# EAGLE schematic flute (EAGLE 6.1)
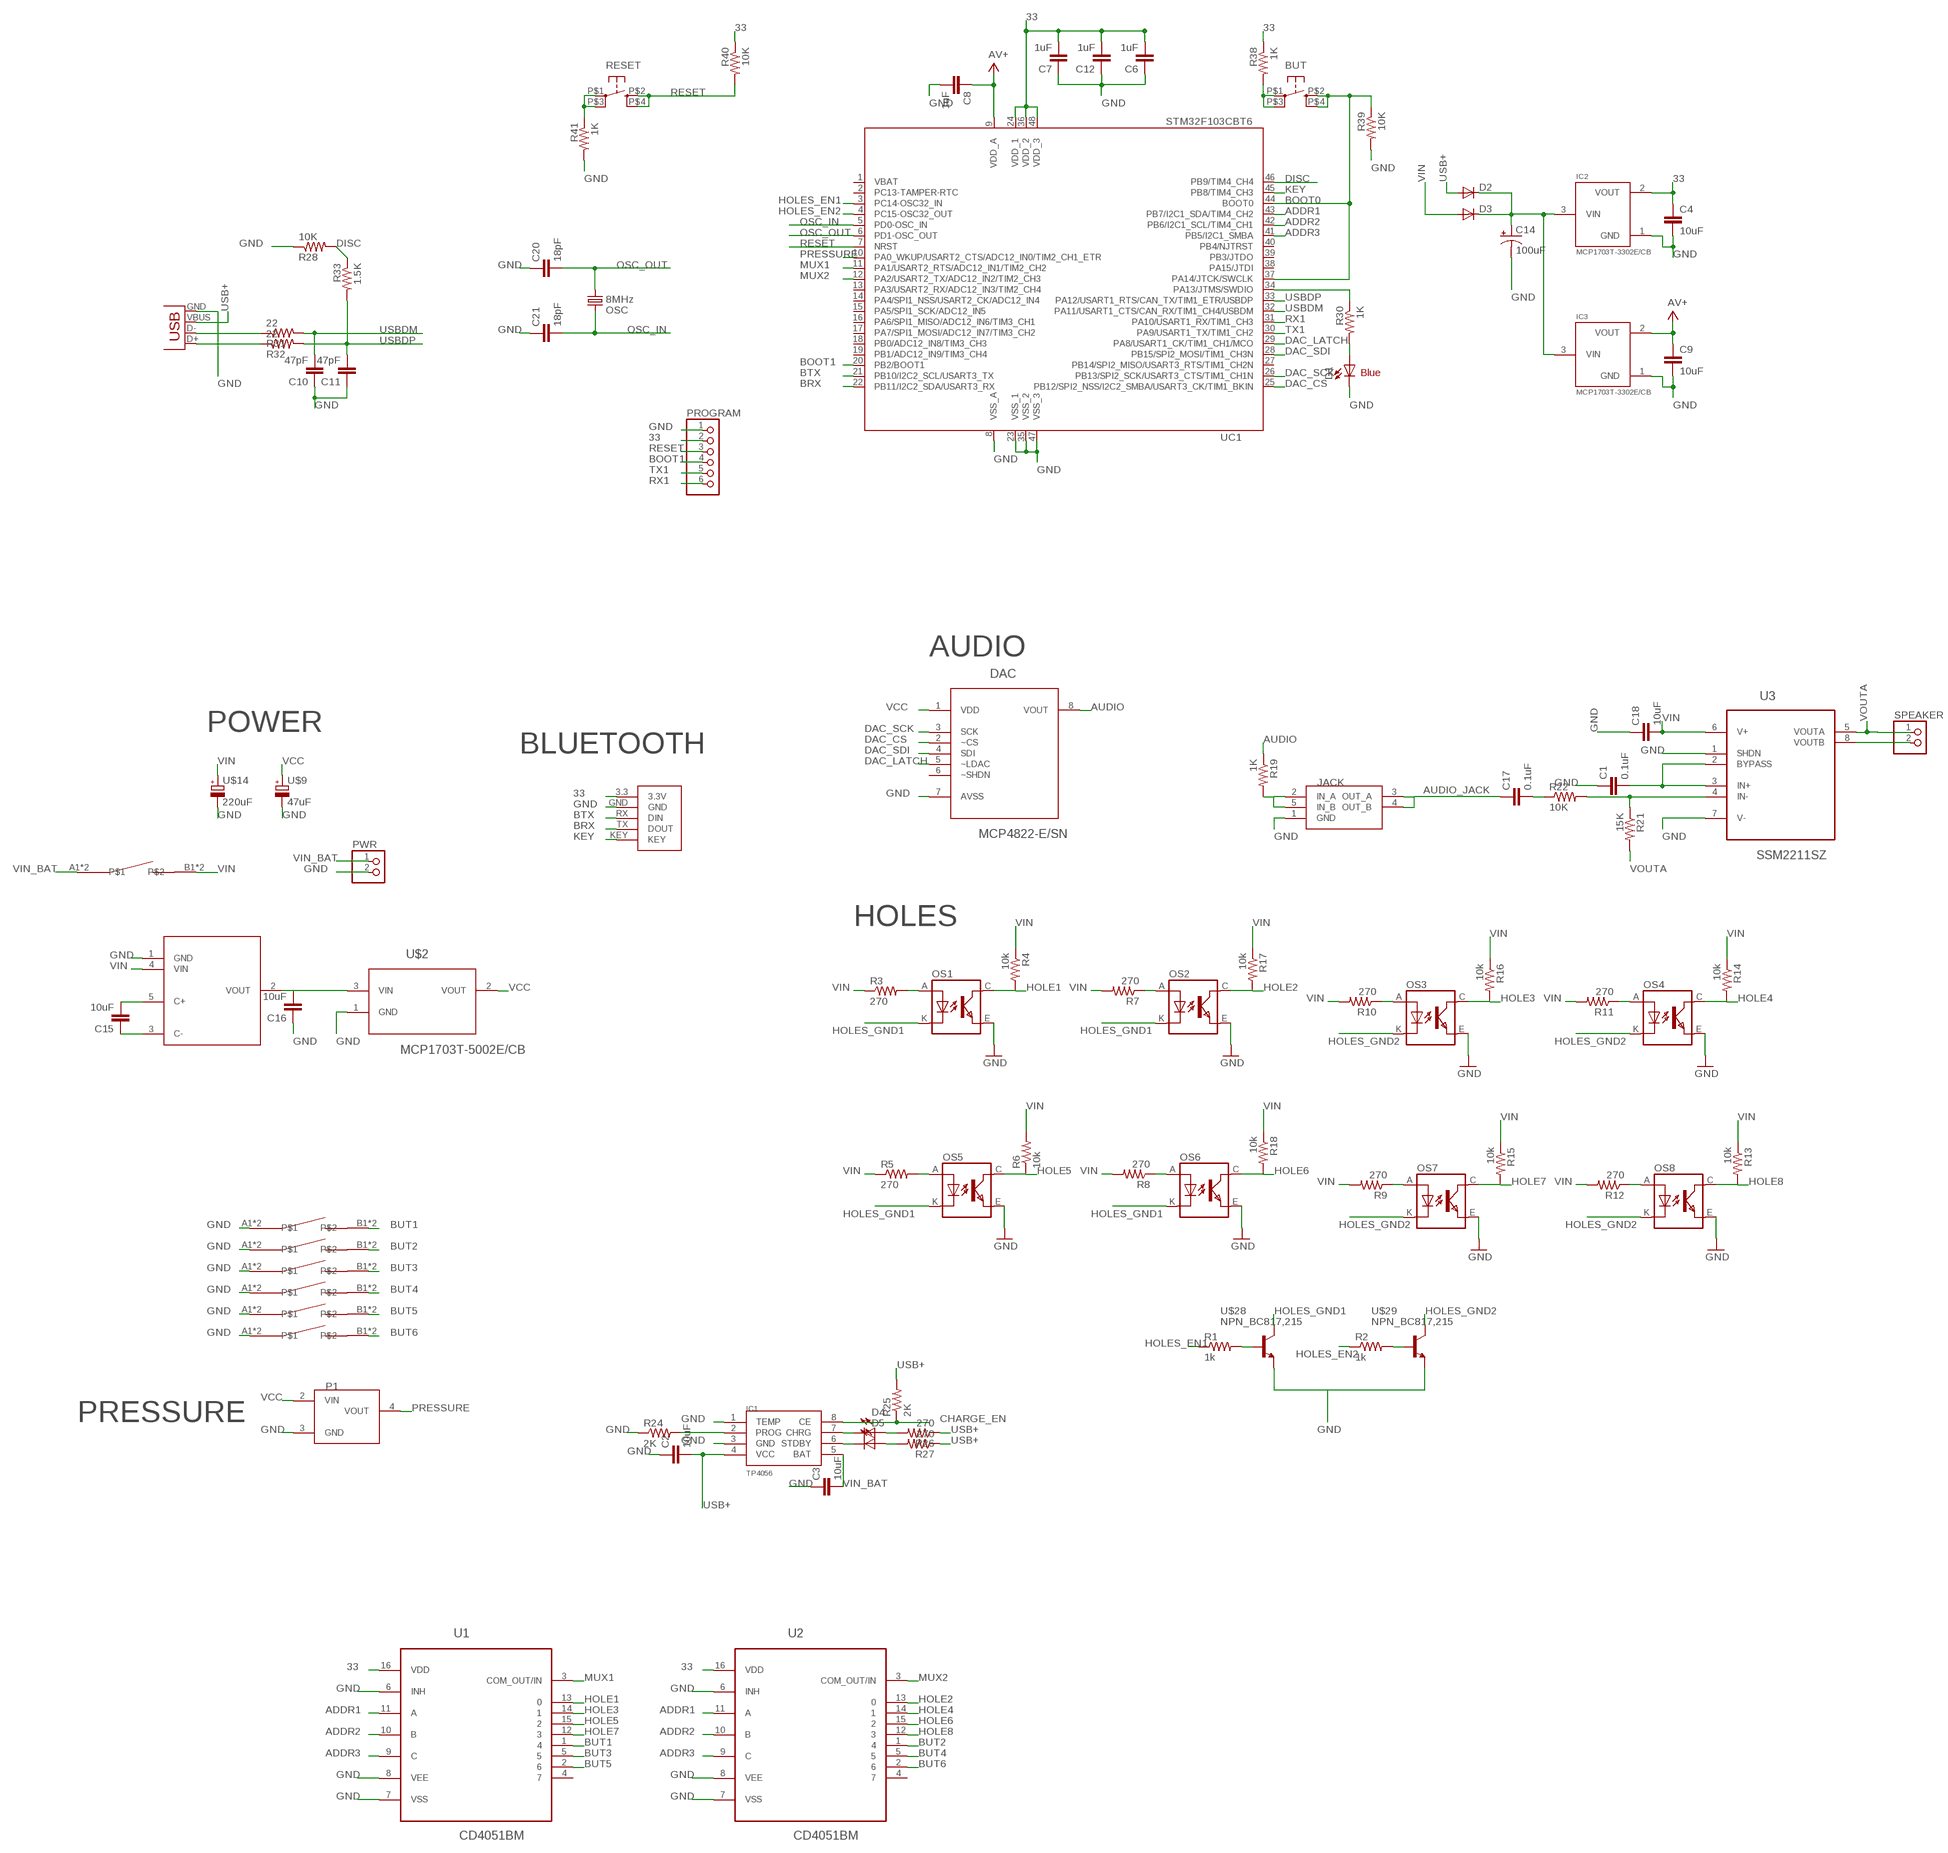
[diagram p0: schematic, sheet 1]

## Parts
BUT  KMR211GLFS  BUTTON-KMR241GLFS  [PUSHBUTTON-KMR241GLFS]
C1  0.1uF  CAP0805  [0805]
C2  10uF  CAP0805  [0805]
C3  10uF  CAP0805  [0805]
C4  10uF  CAP0805  [0805]
C6  1uF  CAP0805  [0805]
C7  1uF  CAP0805  [0805]
C8  1uF  CAP0805  [0805]
C9  10uF  CAP0805  [0805]
C10  47pF  CAP0805  [0805]
C11  47pF  CAP0805  [0805]
C12  1uF  CAP0805  [0805]
C14  100uF  CAP_POL1206  [EIA3216]
C15  10uF  CAP0805  [0805]
C16  10uF  CAP0805  [0805]
C17  0.1uF  CAP0805  [0805]
C18  10uF  CAP0805  [0805]
C20  18pF  CAP0805  [0805]
C21  18pF  CAP0805  [0805]
D1  Blue  LED1206  [LED-1206]
D2  DIODESOD  [SOD-323]
D3  DIODESOD  [SOD-323]
D4  Red  LED1206  [LED-1206]
D5  Green  LED1206  [LED-1206]
DAC  MCP4822-E/SN  [SOIC8-N_MC]
IC1  TP4056  [SOP-8]
IC2  MCP1703T-3302E/CB  MCP1700T  [SOT23]
IC3  MCP1703T-3302E/CB  MCP1700T  [SOT23]
JACK  JACK  [3F07]
OS1  TCRT5000  [TCRT5000]
OS2  TCRT5000  [TCRT5000]
OS3  TCRT5000  [TCRT5000]
OS4  TCRT5000  [TCRT5000]
OS5  TCRT5000  [TCRT5000]
OS6  TCRT5000  [TCRT5000]
OS7  TCRT5000  [TCRT5000]
OS8  TCRT5000  [TCRT5000]
OSC  8MHz  CRYSTAL5X3  [CRYSTAL-SMD-5X3]
P1  PRESSURE_SENSOR  [MPXV5050GP]
PROGRAM  CONNEC_1X066PADS  [6PADS]
PWR  CONNEC_1X02BASIC  [CONNEC_1X02]
R1  1k  RESISTOR0805-RES  [0805]
R2  1k  RESISTOR0805-RES  [0805]
R3  270  RESISTOR0805-RES  [0805]
R4  10k  RESISTOR0805-RES  [0805]
R5  270  RESISTOR0805-RES  [0805]
R6  10k  RESISTOR0805-RES  [0805]
R7  270  RESISTOR0805-RES  [0805]
R8  270  RESISTOR0805-RES  [0805]
R9  270  RESISTOR0805-RES  [0805]
R10  270  RESISTOR0805-RES  [0805]
R11  270  RESISTOR0805-RES  [0805]
R12  270  RESISTOR0805-RES  [0805]
R13  10k  RESISTOR0805-RES  [0805]
R14  10k  RESISTOR0805-RES  [0805]
R15  10k  RESISTOR0805-RES  [0805]
R16  10k  RESISTOR0805-RES  [0805]
R17  10k  RESISTOR0805-RES  [0805]
R18  10k  RESISTOR0805-RES  [0805]
R19  1K  RESISTOR0805-RES  [0805]
R21  15K  RESISTOR0805-RES  [0805]
R22  10K  RESISTOR0805-RES  [0805]
R24  2K  RESISTOR0805-RES  [0805]
R25  2K  RESISTOR0805-RES  [0805]
R26  270  RESISTOR0805-RES  [0805]
R27  270  RESISTOR0805-RES  [0805]
R28  10K  RESISTOR0805-RES  [0805]
R30  1K  RESISTOR0805-RES  [0805]
R31  22  RESISTOR0805-RES  [0805]
R32  22  RESISTOR0805-RES  [0805]
R33  1.5K  RESISTOR0805-RES  [0805]
R38  1K  RESISTOR0805-RES  [0805]
R39  10K  RESISTOR0805-RES  [0805]
R40  10K  RESISTOR0805-RES  [0805]
R41  1K  RESISTOR0805-RES  [0805]
RESET  KMR211GLFS  BUTTON-KMR241GLFS  [PUSHBUTTON-KMR241GLFS]
SPEAKER  CONNEC_1X02BASIC  [CONNEC_1X02]
U1  CD4051BM  [SOIC127P600X175-16N]
U2  CD4051BM  [SOIC127P600X175-16N]
U3  SSM2211SZ  [SOIC127P600X175-8N]
U$1  MAX1683  [SOT23-5]
U$2  MCP1703T-5002E/CB  [SOT95P300X145-3N]
U$9  47uF  CPOL_EUPANASONIC_D  [PANASONIC_D]
U$14  220uF  CPOL_EUPANASONIC_D8  [PANASONIC_D8]
U$16  SWITCHKCD11  [KCD11]
U$18  SWITCH6X6X10  [SWITCH_6X6X10]
U$19  SWITCH6X6X10  [SWITCH_6X6X10]
U$20  SWITCH6X6X10  [SWITCH_6X6X10]
U$21  SWITCH6X6X10  [SWITCH_6X6X10]
U$22  SWITCH6X6X10  [SWITCH_6X6X10]
U$23  SWITCH6X6X10  [SWITCH_6X6X10]
U$24  HC05  [HC-05]
U$28  NPN_BC817,215  [SOT-23]
U$29  NPN_BC817,215  [SOT-23]
UC1  STM32F103CBT6  STM32F103CB  [LQFP48]
X1  USB-MINIB  USBSMD  [USB-MINIB]

## Nets
32: BUT.P$2 BUT.P$4 R39.1 UC1.37(PA14/JTCK/SWCLK) UC1.44(BOOT0)
33: C4.1 C6.2 C7.2 C12.2 IC2.2(VOUT) PROGRAM.2 R38.1 R40.1 U1.16(VDD) U2.16(VDD) U$24.3.3(3.3V) UC1.24(VDD_1) UC1.36(VDD_2) UC1.48(VDD_3)
ADDR1: U1.11(A) U2.11(A) UC1.43(PB7/I2C1_SDA/TIM4_CH2)
ADDR2: U1.10(B) U2.10(B) UC1.42(PB6/I2C1_SCL/TIM4_CH1)
ADDR3: U1.9(C) U2.9(C) UC1.41(PB5/I2C1_SMBA)
AUDIO: DAC.8(VOUT) R19.1
AUDIO_JACK: C17.1 JACK.3(OUT_A) JACK.4(OUT_B)
AV+: C8.1 C9.1 IC3.2(VOUT) UC1.9(VDD_A)
BOOT1: PROGRAM.4 UC1.20(PB2/BOOT1)
BRX: U$24.TX(DOUT) UC1.22(PB11/I2C2_SDA/USART3_RX)
BTX: U$24.RX(DIN) UC1.21(PB10/I2C2_SCL/USART3_TX)
BUT1: U1.1 U$18.B1 U$18.B2
BUT2: U2.1 U$19.B1 U$19.B2
BUT3: U1.5 U$20.B1 U$20.B2
BUT4: U2.5 U$21.B1 U$21.B2
BUT5: U1.2 U$22.B1 U$22.B2
BUT6: U2.2 U$23.B1 U$23.B2
CHARGE_EN: IC1.8(CE) R25.1
DAC_CS: DAC.2(~CS) UC1.25(PB12/SPI2_NSS/I2C2_SMBA/USART3_CK/TIM1_BKIN)
DAC_LATCH: DAC.5(~LDAC) UC1.29(PA8/USART1_CK/TIM1_CH1/MCO)
DAC_SCK: DAC.3(SCK) UC1.26(PB13/SPI2_SCK/USART3_CTS/TIM1_CH1N)
DAC_SDI: DAC.4(SDI) UC1.28(PB15/SPI2_MOSI/TIM1_CH3N)
DISC: R28.2 R33.1 UC1.46(PB9/TIM4_CH4)
GND [alim]: C1.1 C2.1 C3.1 C4.2 C6.1 C7.1 C8.2 C9.2 C10.1 C11.1 C12.1 C14.C(-) C16.1 C18.1 C20.1 C21.1 D1.C DAC.7(AVSS) IC1.1(TEMP) IC1.3(GND) IC2.1(GND) IC3.1(GND) JACK.1(GND) OS1.E(EMITTER) OS2.E(EMITTER) OS3.E(EMITTER) OS4.E(EMITTER) OS5.E(EMITTER) OS6.E(EMITTER) OS7.E(EMITTER) OS8.E(EMITTER) P1.3(GND) PROGRAM.1 PWR.2 R24.1 R28.1 R39.2 R41.2 U1.6(INH) U1.7(VSS) U1.8(VEE) U2.6(INH) U2.7(VSS) U2.8(VEE) U3.1(SHDN) U3.7(V-) U$1.1(GND) U$2.1(GND) U$9.- U$14.- U$18.A1 U$18.A2 U$19.A1 U$19.A2 U$20.A1 U$20.A2 U$21.A1 U$21.A2 U$22.A1 U$22.A2 U$23.A1 U$23.A2 U$24.GND U$28.2(E) U$29.2(E) UC1.8(VSS_A) UC1.23(VSS_1) UC1.35(VSS_2) UC1.47(VSS_3) X1.GND
HOLE1: OS1.C(COLLECTOR) R4.2 U1.13
HOLE2: OS2.C(COLLECTOR) R17.2 U2.13
HOLE3: OS3.C(COLLECTOR) R16.2 U1.14
HOLE4: OS4.C(COLLECTOR) R14.2 U2.14
HOLE5: OS5.C(COLLECTOR) R6.1 U1.15
HOLE6: OS6.C(COLLECTOR) R18.2 U2.15
HOLE7: OS7.C(COLLECTOR) R15.2 U1.12
HOLE8: OS8.C(COLLECTOR) R13.2 U2.12
HOLES_EN1: R1.1 UC1.3(PC14-OSC32_IN)
HOLES_EN2: R2.1 UC1.4(PC15-OSC32_OUT)
HOLES_GND1: OS1.K(CATHODE) OS2.K(CATHODE) OS5.K(CATHODE) OS6.K(CATHODE) U$28.3(C)
HOLES_GND2: OS3.K(CATHODE) OS4.K(CATHODE) OS7.K(CATHODE) OS8.K(CATHODE) U$29.3(C)
KEY: U$24.KEY UC1.45(PB8/TIM4_CH3)
MUX1: U1.3(COM_OUT/IN) UC1.11(PA1/USART2_RTS/ADC12_IN1/TIM2_CH2)
MUX2: U2.3(COM_OUT/IN) UC1.12(PA2/USART2_TX/ADC12_IN2/TIM2_CH3)
N$1: C1.2 U3.2(BYPASS) U3.3(IN+)
N$2: R21.1 R22.2 U3.4(IN-)
N$3: R1.2 U$28.1(B)
N$4: R2.2 U$29.1(B)
N$5: OS1.A(ANODE) R3.2
N$6: D5.A R27.2
N$7: OS2.A(ANODE) R7.1
N$8: JACK.2(IN_A) JACK.5(IN_B) R19.2
N$9: OS3.A(ANODE) R10.1
N$10: C17.2 R22.1
N$11: OS4.A(ANODE) R11.1
N$12: SPEAKER.2 U3.8(VOUTB)
N$13: OS5.A(ANODE) R5.2
N$15: OS6.A(ANODE) R8.1
N$16: D4.A R26.2
N$17: OS7.A(ANODE) R9.1
N$19: OS8.A(ANODE) R12.1
N$21: IC1.2(PROG) R24.2
N$22: C15.1 U$1.3(C-)
N$24: D4.C IC1.7(CHRG)
N$25: D5.C IC1.6(STDBY)
N$26: BUT.P$1 BUT.P$3 R38.2
N$27: R41.1 RESET.P$1 RESET.P$3
N$28: D1.A R30.2
N$29: R30.1 UC1.34(PA13/JTMS/SWDIO)
N$30: C15.2 U$1.5(C+)
N$31: C16.2 U$1.2(VOUT) U$2.3(VIN)
N$59: R31.1 X1.D-
N$60: R32.1 X1.D+
OSC_IN: C21.2 OSC.3 UC1.5(PD0-OSC_IN)
OSC_OUT: C20.2 OSC.1 UC1.6(PD1-OSC_OUT)
PRESSURE: P1.4(VOUT) UC1.10(PA0_WKUP/USART2_CTS/ADC12_IN0/TIM2_CH1_ETR)
RESET: PROGRAM.3 R40.2 RESET.P$2 RESET.P$4 UC1.7(NRST)
RX1: PROGRAM.6 UC1.31(PA10/USART1_RX/TIM1_CH3)
TX1: PROGRAM.5 UC1.30(PA9/USART1_TX/TIM1_CH2)
USB+: C2.2 D2.2(A) IC1.4(VCC) R25.2 R26.1 R27.1 X1.VBUS
USBDM: C10.2 R31.2 UC1.32(PA11/USART1_CTS/CAN_RX/TIM1_CH4/USBDM)
USBDP: C11.2 R32.2 R33.2 UC1.33(PA12/USART1_RTS/CAN_TX/TIM1_ETR/USBDP)
VCC [alim]: DAC.1(VDD) P1.2(VIN) U$2.2(VOUT) U$9.+
VIN [alim]: C18.2 D3.2(A) R3.1 R4.1 R5.1 R6.2 R7.2 R8.2 R9.2 R10.2 R11.2 R12.2 R13.1 R14.1 R15.1 R16.1 R17.1 R18.1 U3.6(V+) U$1.4(VIN) U$14.+ U$16.B1 U$16.B2
VIN_BAT [alim]: C3.2 IC1.5(BAT) PWR.1 U$16.A1 U$16.A2
VIN_REGS [alim]: C14.A(+) D2.1(C) D3.1(C) IC2.3(VIN) IC3.3(VIN)
VOUTA: R21.2 SPEAKER.1 U3.5(VOUTA)
Unconnected: DAC.6(~SHDN) U1.4 U2.4 UC1.2(PC13-TAMPER-RTC) UC1.13(PA3/USART2_RX/ADC12_IN3/TIM2_CH4) UC1.14(PA4/SPI1_NSS/USART2_CK/ADC12_IN4) UC1.15(PA5/SPI1_SCK/ADC12_IN5) UC1.16(PA6/SPI1_MISO/ADC12_IN6/TIM3_CH1) UC1.17(PA7/SPI1_MOSI/ADC12_IN7/TIM3_CH2) UC1.18(PB0/ADC12_IN8/TIM3_CH3) UC1.19(PB1/ADC12_IN9/TIM3_CH4) UC1.27(PB14/SPI2_MISO/USART3_RTS/TIM1_CH2N) UC1.38(PA15/JTDI) UC1.39(PB3/JTDO) UC1.40(PB4/NJTRST)

## Notes on the sheet
- BOOT0
- Blue
- AUDIO
- POWER
- BLUETOOTH
- HOLES
- PRESSURE

## Power pins joined to a net without a drawn wire
VBAT: UC1.1(VBAT)

## Library data of the parts
BUT RESET = okie:BUTTON-KMR241GLFS
C1-C3 C6-C8 C10-C12 C15-C18 C20 C21 = SparkFun-Passives:CAP: Capacitor Standard 0603 ceramic capacitor, and 0.1" leaded capacitor.
C4 C9 = SparkFun2:CAP: Capacitor Standard 0603 ceramic capacitor, and 0.1" leaded capacitor.
C14 = SparkFun3:CAP_POL: Capacitor Polarized These are standard SMD and PTH capacitors. Normally 10uF, 47uF, and 100uF in electrolytic and tantalum varieties. Always verify the external diameter of the through hole cap, it varies with capacity, voltage, and manufacturer. The EIA devices should be standard.
D1 D4 D5 = SparkFun:LED: LEDs Standard schematic elements and footprints for 5mm, 3mm, 1206, and 0603 sized LEDs. 5mm - Spark Fun Electronics SKU : COM-00529 (and others)
D2 D3 = SparkFun3:DIODE: Diode These are standard reverse protection diodes and small signal diodes. SMA package can handle up to about 1A. SOD-323 can handle about 200mA. What the SOD-323 package when ordering, there are some mfgs out there that are 5-pin packages.
DAC = rhoban:MCP4822-E/SN: 12 Bit DAC; DESCRIPTION: 12 Bit DAC; MPN: MCP4822-E/SN; OC_FARNELL: 1439414; OC_NEWARK: 31K2975; PACKAGE: SOIC-8; SUPPLIER: Microchip
IC1 = TP4056:TP4056
IC2 IC3 = okie:MCP1700T
JACK = rhoban:JACK
OS1-OS8 = tcrt5000:TCRT5000
OSC = SparkFun2:CRYSTAL: Crystals Various standard crystals. Proven footprints. Spark Fun Electronics SKU : COM-00534
P1 = rhoban:PRESSURE_SENSOR
PROGRAM = rhoban:CONNEC_1X06
PWR SPEAKER = rhoban:CONNEC_1X02
R1-R19 R21 R22 R24-R28 R30-R33 R38-R41 = SparkFun-Passives:RESISTOR: Resistor Basic schematic elements and footprints for 0603, 1206, and PTH resistors.
U1 U2 = rhoban:CD4051BM: CMOS Analog Multiplexers/Demultiplexers with Logic Level Conversion; MPN: CD4051BM; OC_FARNELL: 8388970; OC_NEWARK: 05B5595; PACKAGE: SOIC-16; SUPPLIER: Texas Instruments
U3 = rhoban:SSM2211SZ: Low Distortion, 1.5 W Audio Power Amplifier; MPN: SSM2211SZ; OC_FARNELL: 9994440; OC_NEWARK: 19M1049; PACKAGE: SOIC-8; SUPPLIER: Analog Devices
U$1 = rhoban:MAX1683
U$2 = rhoban:MCP1703T-5002E/CB: Low Quiescent Current LDO Regulator; MPN: MCP1703T-5002E/CB; OC_FARNELL: 1439519; OC_NEWARK: 40M0640; PACKAGE: SOT-3; SUPPLIER: Microchip
U$9 U$14 = rhoban:CPOL_EU: 47uF: http://fr.farnell.com/panasonic-electronic-components/eee1ca470sp/condensateur-elec-alu-47uf-16v/dp/9696946 220uF: http://fr.farnell.com/panasonic-electronic-components/eeefk1c221xp/condensateur-elec-alu-220uf-16v/dp/1850103
U$16 U$18-U$23 = rhoban:SWITCH
U$24 = rhoban:HC05
U$28 U$29 = rhoban:NPN
UC1 = stm32:STM32F103CB
X1 = SparkFun2:USB: USB Connectors USB-B-PTH is fully proven SKU : PRT-00139 USB-miniB is fully proven SKU : PRT-00587 USB-A-PCB is untested. USB-A-H is throughly reviewed, but untested. Spark Fun Electronics SKU : PRT-00437 USB-B-SMT is throughly reviewed, but untested. Needs silkscreen touching up. USB-A-S has not been used/tested USB-MB-H has not been used/tested

## Net classes
1 alim: width 0.381 mm, clearance 0.076 mm